# EAGLE design 121_jinkan (EAGLE 9.6.0)
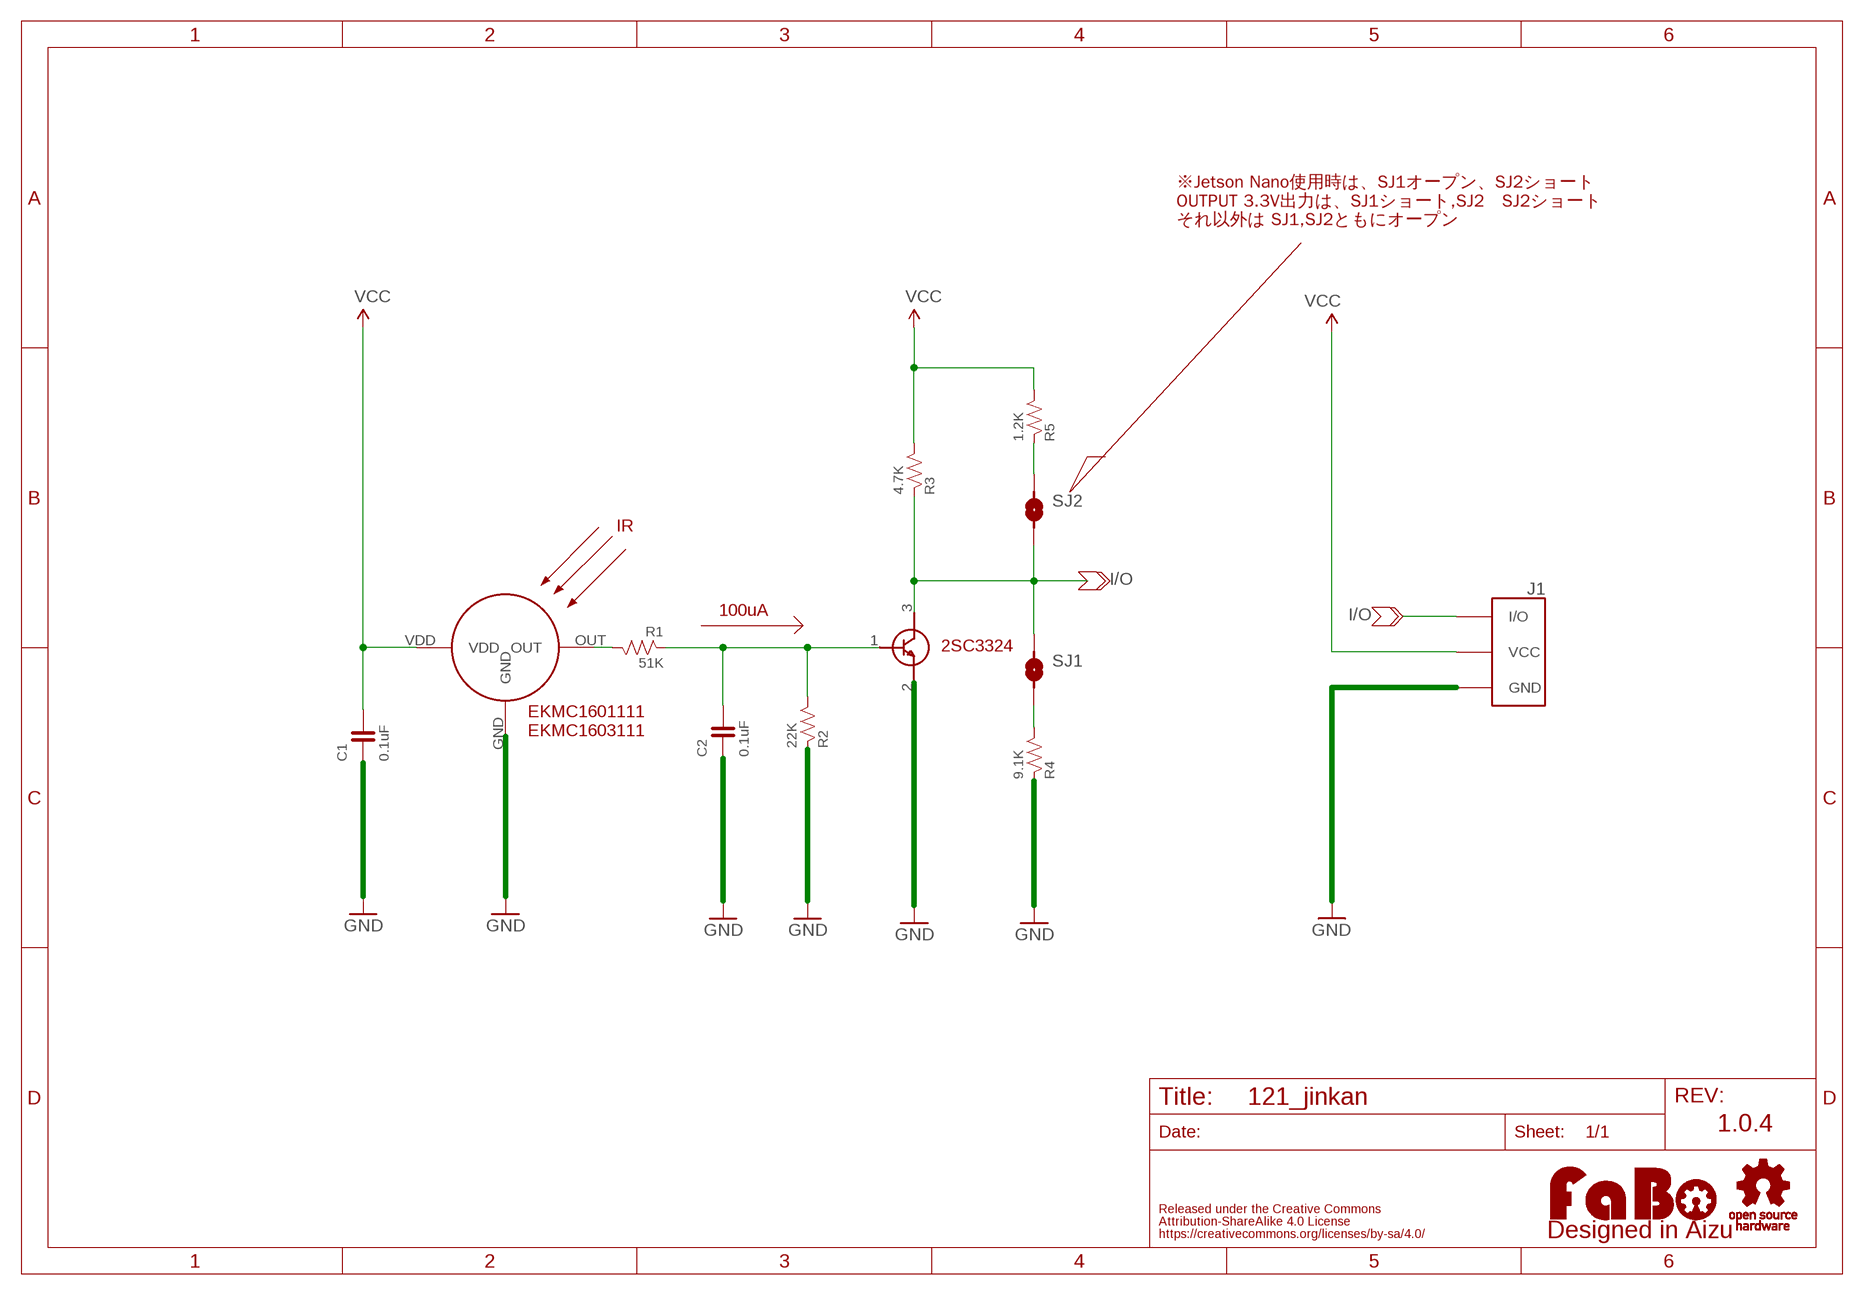
[diagram p0: schematic, sheet 1]

## Parts
C1  0.1uF  CAPACITOR-0603_NARROW  [0603-NARROW]
C2  0.1uF  CAPACITOR-0603_NARROW  [0603-NARROW]
J1  FABO_BRICK_3PIN  [FABO_BRICK_3PIN]
LOGO1  LOGO_FABO-M  [LOGO_FABO_M]
R1  51K  RESISTOR-0603  [0603]
R2  22K  RESISTOR-0603  [0603]
R3  4.7K  RESISTOR-0603  [0603]
R4  9.1K  RESISTOR-0603  [0603]
R5  1.2K  RESISTOR-0603  [0603]
SJ1  SMD-JUMPER-LSMD-JUMER_L  [SMD-JUMPER-L]
SJ2  SMD-JUMPER-LSMD-JUMER_L  [SMD-JUMPER-L]
U$2  LOGO_OSHW-M_BOTTOM  [LOGO_OSHW_M_BOTTOM]
U$4  EKBM  [EKMB]
U$5  TRANSISTOR-NPN  [SOT-23]

## Nets
GND: C1.1 C2.1 J1.GND R2.1 R4.1 U$4.GND U$5.2(E)
I/O: J1.I/O R3.1 SJ1.1 SJ2.2 U$5.3(C)
N$1: R1.2 U$4.OUT
N$2: C2.2 R1.1 R2.2 U$5.1(B)
N$3: R4.2 SJ1.2
N$4: R5.1 SJ2.1
VCC: C1.2 J1.VCC R3.2 R5.2 U$4.VDD

## Notes on the sheet
- ※Jetson Nano使用時は、SJ1オープン、SJ2ショート
  OUTPUT 3.3V出力は、SJ1ショート,SJ2　SJ2ショート
  それ以外は SJ1,SJ2ともにオープン
- IR
- 100uA
- 2SC3324
- EKMC1601111
  EKMC1603111
- 1.0.4

## Library data of the parts
C1 C2 = FaBo-Capacitor:CAPACITOR: CAPACITOR
J1 = FaBo-Template:FABO_BRICK_3PIN: FaBo Brick 3pin
LOGO1 = component:LOGO_FABO
R1 R2 R4 R5 = FaBo-Resistors:RESISTOR: RESISTOR
R3 = FaBo-Resistors:RESISTOR: RESISTOR; SPICEPREFIX: R
SJ1 SJ2 = FaBo-etc:SMD-JUMPER-L
U$2 = FaBo-etc:LOGO_OSHW
U$4 = FaBo-Sensor:EKBM
U$5 = FaBo-Transistor:TRANSISTOR

## Board
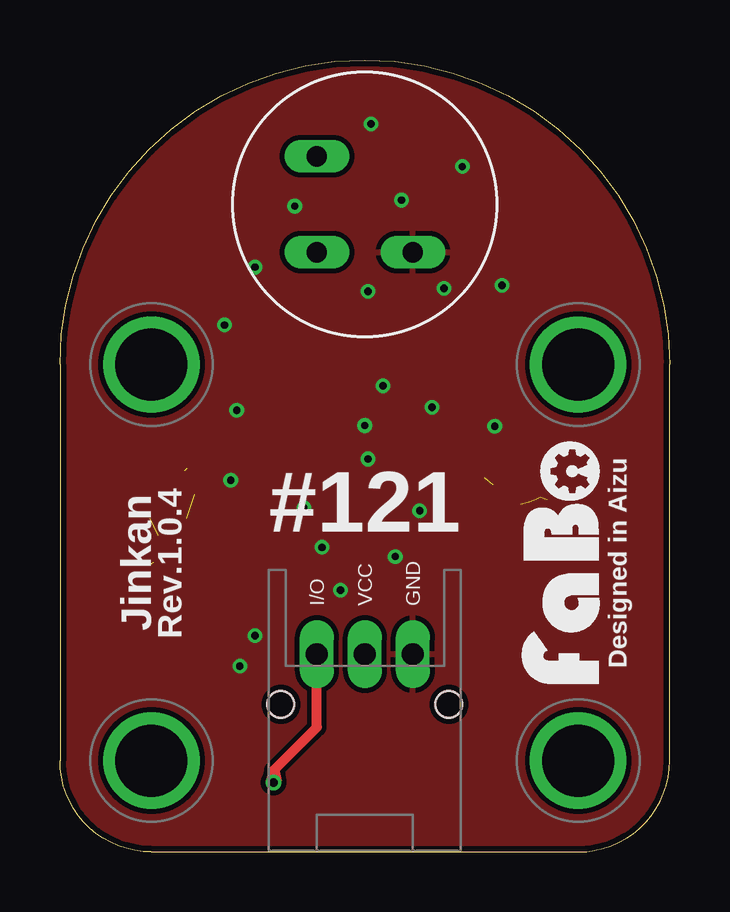
[diagram p1: board, top side]
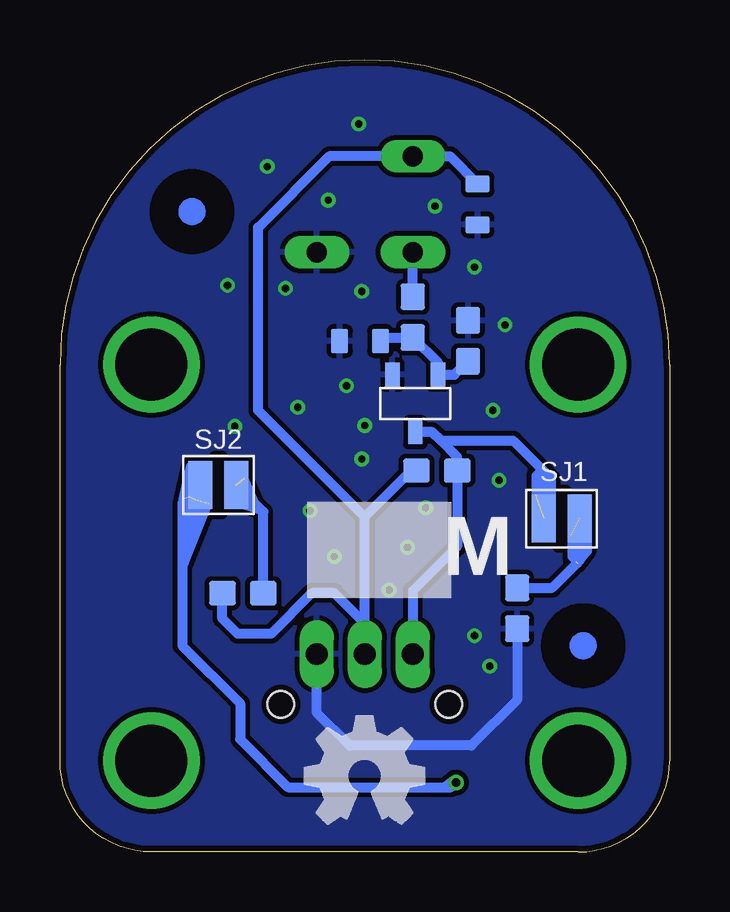
[diagram p2: board, bottom side, seen from below]

Size 25.4 x 33.02 mm. Coordinates in mm from the lower left corner, seen from the top.
Copper layers (1*16): Top 0.035mm / dielectric 1.6mm / Bottom 0.035mm
Design rules "PCBway": minimum track width 6mil, minimum drill 12mil, track to track 6mil, track to pad 6mil, pad to pad 6mil, via to via 6mil, smd to smd 6mil, copper to edge 10mil, drill to drill 10mil, minimum pad ring 10mil, minimum via ring 6mil, stop-mask expansion 2mil, vias tented up to drill 100mil, thermal gap 8mil

### Footprints (pad centres in the part's own frame; a part is rotated, then mirrored left to right if it is on the bottom)
0603-NARROW = smd 0.71 x 1: 1 -0.85,0; 2 0.85,0
FABO_BRICK_3PIN = drill 0.9 pad 1.422 long: GND 2,-8.255; I/O -2,-8.255; VCC 0,-8.255 | drill 3 pad 3.81: P$1 -8.89,3.81; P$2 8.89,3.81; P$3 -8.89,-12.7; P$4 8.89,-12.7 | hole 1.1: -3.5,-10.355; 3.5,-10.355
0603 = smd 1.1 x 1: 1 -0.85,0; 2 0.85,0
SMD-JUMPER-L = smd 1 x 2: 1 -0.75,0; 2 0.75,0
EKMB = drill 0.85 long: GND -2,2; OUT 2,2; VDD 2,-2
SOT-23 = smd 0.6 x 1: 1 -0.95,-1.2; 2 0.95,-1.2; 3 0,1.2

### Placement (x,y rotation side)
C1  8,27 90 bottom
C2  12.9,21.3 0 bottom
J1  12.7,16.51 0 top
LOGO1  22.86,12.06 90 top
R1  10.7,22.3 90 bottom
R2  8.4,21.32 270 bottom
R3  9.7,15.9 180 bottom
R4  6.35,10.16 90 bottom
R5  17.78,10.79 180 bottom
SJ1  4.5,13.9 0 bottom
SJ2  18.8,15.3 180 bottom
U$2  12.7,3.17 0 top
U$4  12.7,27 180 top
U$5  10.6,18.7 180 bottom
U$6  [MARK_POINT_3MM]  3.6,8.6 0 bottom
U$7  [MARK_POINT_3MM]  19.9,26.7 0 bottom

### Tracks (layer width: path | path; a pad name or v marks a point on that pad's centre or on a via)
GND  (via drill 0.3)
  Bottom 0.406: J1.GND 14.7,5.81 13.34,4.45 8.26,4.45 6.35,6.35 R4.1
  other vias: 18.11,17.75 11.68,10.92 10.92,12.7 10.16,14.35 13.97,12.32 8.13,9.02 7.11,15.49 7.37,18.41 13.46,19.43 12.83,16.38 14.99,14.22 15.49,18.54 12.7,17.78 16,23.5 18.41,23.62 12.95,30.35 16.76,28.57 14.22,27.18 9.78,26.92 12.83,23.37 8.13,24.38 6.86,21.97 7.49,7.75
  pour Bottom (isolate 0.203): 0,0 25.4,0 25.4,33.02 0,33.02
  pour Top (isolate 0.203): 0,0 25.4,0 25.4,33.02 0,33.02
I/O  (via drill 0.35)  (6 unrouted)
  Top 0.406: v8.9,2.9 8.9,3.4 8.92,3.42 | 8.92,3.42 10.7,5.2 J1.I/O | 8.92,3.42 8.78,2.94 v8.9,2.9 | 8.92,3.42 9.02,2.92 v8.9,2.9
  Bottom 0.305: 5.6,14.9 5.6,15.7 5.3,16 | 4.9,14.9 4.9,15.6 5.2,15.9 | 20.3,14.7 20,16.1 | 20.1,13.3 19.8,14.7 | 20.3,13.4 20,14.8 | 20.1,12.8 19.5,14.6 | 19.2,14.5 20.2,12
  Bottom 0.406: U$5.3 9.88,17.5 9.53,17.14 | 9.53,17.14 8.85,16.47 R3.1 8.85,12.74 10.7,10.89 J1.I/O | 9.53,17.14 6.51,17.14 5.25,15.88 SJ1.1 | 9.38,2.7 15.9,2.7 17.9,4.7 17.9,6.2 20.3,8.6 20.3,13.4 20.3,14.55 SJ2.2 | 9.38,2.7 9.1,2.7 v8.9,2.9 | 9.38,2.7 8.97,3 v8.9,2.9 | 9.38,2.7 8.88,2.78 v8.9,2.9
N$1
  Bottom 0.406: R1.2 U$4.OUT
N$2
  Bottom 0.406: C2.2 11.9,21.45 R1.1 9.65,20.4 U$5.1 8.96,19.9 R2.2
N$3  (2 unrouted)
  Bottom 0.305: 4.1,13.2 4.1,12.3 3.9,12.1 | 3.4,13.1 3.4,12.53 3.8,12
  Bottom 0.406: R4.2 4.89,11.01 3.75,12.15 SJ1.2
N$4  (1 unrouted)
  Bottom 0.305: 18.2,14.6 17.12,14.24 17.7,15.6
  Bottom 0.406: SJ2.1 16.93,14.18 R5.1
VCC
  Bottom 0.152: 12.7,9.53 J1.VCC
  Bottom 0.406: C1.2 9.15,29 U$4.VDD 14.18,29 17.14,26.04 17.14,18.41 12.7,13.97 | J1.VCC 12.7,13.97 | 12.7,9.53 13.97,10.79 14.9,10.79 16.6,9.1 18,9.1 18.63,9.73 R5.2 | R3.2 10.77,15.9 12.7,13.97

### Text on the board
tPlace: #121 | Jinkan | Designed in Aizu | Rev.1.0.4
bPlace: M